# EAGLE design garage (EAGLE 7.6.0)
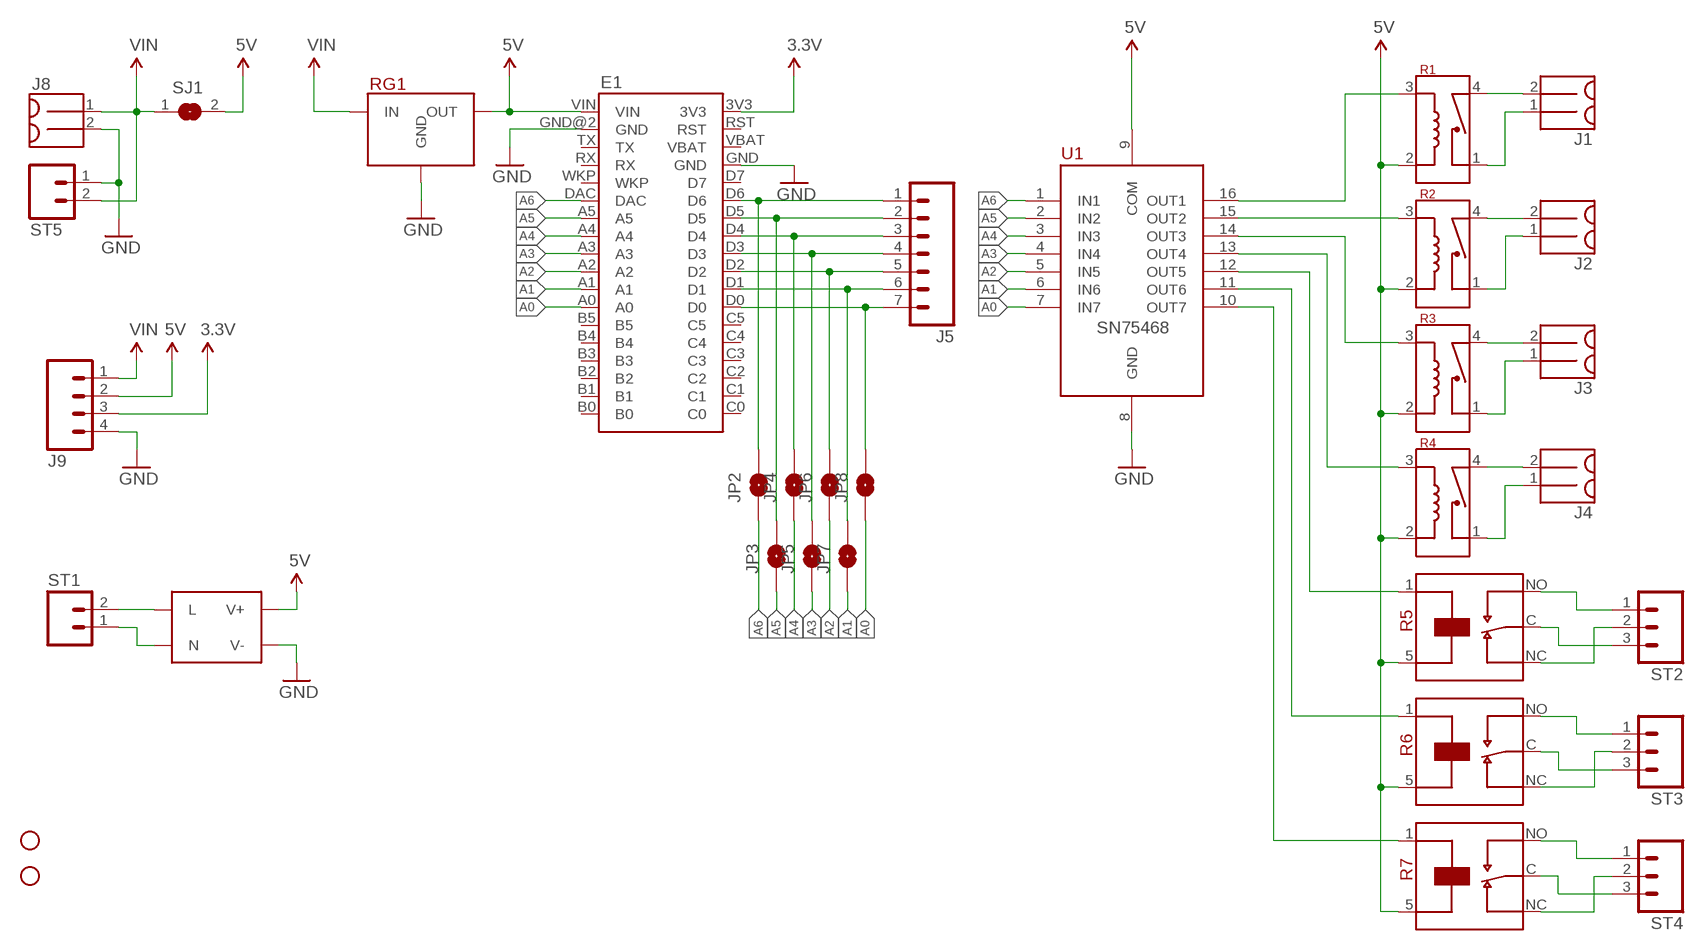
[diagram p0: schematic, sheet 1]

## Parts
E1  ELECTRON  [ELECTRON]
H1  STAND-OFF  [STAND-OFF]
H2  STAND-OFF  [STAND-OFF]
J1  MOLEX_MINILITE_TRAP_2  [MOLEX_MINILITE_TRAP_2]
J2  MOLEX_MINILITE_TRAP_2  [MOLEX_MINILITE_TRAP_2]
J3  MOLEX_MINILITE_TRAP_2  [MOLEX_MINILITE_TRAP_2]
J4  MOLEX_MINILITE_TRAP_2  [MOLEX_MINILITE_TRAP_2]
J5  M07  [1X07]
J8  MOLEX_MINILITE_TRAP_2  [MOLEX_MINILITE_TRAP_2]
J9  M04PTH  [1X04]
JP2  JUMPER-PAD-2-NOYES_SILK  [PAD-JUMPER-2-NO_YES_SILK]
JP3  JUMPER-PAD-2-NOYES_SILK  [PAD-JUMPER-2-NO_YES_SILK]
JP4  JUMPER-PAD-2-NOYES_SILK  [PAD-JUMPER-2-NO_YES_SILK]
JP5  JUMPER-PAD-2-NOYES_SILK  [PAD-JUMPER-2-NO_YES_SILK]
JP6  JUMPER-PAD-2-NOYES_SILK  [PAD-JUMPER-2-NO_YES_SILK]
JP7  JUMPER-PAD-2-NOYES_SILK  [PAD-JUMPER-2-NO_YES_SILK]
JP8  JUMPER-PAD-2-NOYES_SILK  [PAD-JUMPER-2-NO_YES_SILK]
PS1  IRM_03_PS_3W  [IRM_03_PS_3W]
R1  HE3600_RELAY  [HE3600_RELAY]
R2  HE3600_RELAY  [HE3600_RELAY]
R3  HE3600_RELAY  [HE3600_RELAY]
R4  HE3600_RELAY  [HE3600_RELAY]
R5  G2RL_SPDT  [G2RL_SPDT]
R6  G2RL_SPDT  [G2RL_SPDT]
R7  G2RL_SPDT  [G2RL_SPDT]
RG1  MURATA_REG  [MURATA_REG_HOR]
SJ1  SJ  [SJ]
ST1  SCREWTERM_2  [SCREWTERM_0.2X2]
ST2  SCREWTERM_3  [SCREWTERM_0.2X3]
ST3  SCREWTERM_3  [SCREWTERM_0.2X3]
ST4  SCREWTERM_3  [SCREWTERM_0.2X3]
ST5  SCREWTERM_2  [SCREWTERM_0.2X2]
U1  SN75468  [SOIC16]

## Nets
3.3V: E1.3V3 J9.3
5V: E1.VIN J9.2 PS1.V+ R1.2(R1) R2.2(R1) R3.2(R1) R4.2(R1) R5.5 R6.5 R7.5 RG1.3(OUT) SJ1.2 U1.9(COM)
A0: E1.A0 JP8.1 U1.7(IN7)
A1: E1.A1 JP7.1 U1.6(IN6)
A2: E1.A2 JP6.1 U1.5(IN5)
A3: E1.A3 JP5.1 U1.4(IN4)
A4: E1.A4 JP4.1 U1.3(IN3)
A5: E1.A5 JP3.1 U1.2(IN2)
A6: E1.DAC JP2.1 U1.1(IN1)
GND: E1.GND E1.GND@2(GND) J8.2 J9.4 PS1.V- RG1.2(GND) ST5.1 U1.8(GND)
N$1: PS1.ACL(L) ST1.2
N$2: R4.3(R2) U1.13(OUT4)
N$3: R5.1 U1.12(OUT5)
N$4: R6.1 U1.11(OUT6)
N$5: R7.1 U1.10(OUT7)
N$6: J4.2 R4.4(C2)
N$7: J3.2 R3.4(C2)
N$8: J2.2 R2.4(C2)
N$9: J2.1 R2.1(C1)
N$10: J3.1 R3.1(C1)
N$11: J4.1 R4.1(C1)
N$12: J1.2 R1.4(C2)
N$13: J1.1 R1.1(C1)
N$14: R6.NO ST3.1
N$15: R6.NC ST3.2
N$16: R5.NO ST2.1
N$17: R5.C ST2.3
N$18: R6.C ST3.3
N$19: R7.NC ST4.2
N$20: R7.C ST4.3
N$21: R5.NC ST2.2
N$22: R2.3(R2) U1.15(OUT2)
N$23: PS1.ACN(N) ST1.1
N$25: R7.NO ST4.1
N$30: E1.D0 J5.7 JP8.2
N$31: E1.D1 J5.6 JP7.2
N$32: E1.D2 J5.5 JP6.2
N$33: R1.3(R2) U1.16(OUT1)
N$34: E1.D3 J5.4 JP5.2
N$35: R3.3(R2) U1.14(OUT3)
N$36: E1.D4 J5.3 JP4.2
N$37: E1.D5 J5.2 JP3.2
N$38: E1.D6 J5.1 JP2.2
VIN: J8.1 J9.1 RG1.1(IN) SJ1.1 ST5.2
Unconnected: E1.B0 E1.B1 E1.B2 E1.B3 E1.B4 E1.B5 E1.C0 E1.C1 E1.C2 E1.C3 E1.C4 E1.C5 E1.D7 E1.RST E1.RX E1.TX E1.VBAT E1.WKP

## Library data of the parts
E1 = Puffin:ELECTRON
H1 H2 = SparkFun-Electromechanical:STAND-OFF: #4 Stand Off This is the mechanical footprint for a #4 phillips button head screw. Use the keepout ring to avoid running the screw head into surrounding components. SKU : PRT-00447
J1-J4 J8 = Puffin:MOLEX_MINILITE_TRAP_2
J5 = SparkFun-Connectors:M07: Header 7 Standard 7-pin 0.1" header. Use with straight break away headers (SKU : PRT-00116), right angle break away headers (PRT-00553), swiss pins (PRT-00743), machine pins (PRT-00117), and female headers (PRT-00115). NOTES ON THE VARIANTS LOCK and LOCK_LONGPADS... This footprint was designed to help hold the alignment of a through-hole component (i.e. 7-pin header) while soldering it into place. You may notice that each hole has been shifted either up or down by 0.005 of an inch from it's more standard position (which is usually a perfectly straight line). This slight alteration caused the pins (the squares in the middle) to touch the edges of the holes. Because they are alternating, it causes a "brace" to hold the header in place. 0.005 has proven to be the perfect amount of "off-center" position when using our standard breakaway headers. Although looks a little odd when you look at the bare footprint, once you have a header in there, the alteration is very hard to notice. Also, if you push a header all the way into place, it is covered up entirely on the bottom side. This idea of altering the position of holes to aid alignment will be further integrated into the Sparkfun Library for other footprints. It can help hold any component with 3 or more connection pins.
J9 = SparkFun-Connectors:M04: Header 4 Standard 4-pin 0.1" header. Use with straight break away headers (SKU : PRT-00116), right angle break away headers (PRT-00553), swiss pins (PRT-00743), machine pins (PRT-00117), and female headers (PRT-00115). Molex polarized connector foot print use with SKU : PRT-08231 with associated crimp pins and housings. 1MM SMD Version SKU: PRT-10208; PROD_ID: CONN-09696
JP2-JP8 = SparkFun-Passives:JUMPER-PAD-2-NO
PS1 = Puffin:IRM_03_PS_3W
R1-R4 = Puffin:HE3600_RELAY
R5-R7 = Puffin:G2RL_SPDT
RG1 = Puffin:MURATA_REG
SJ1 = jumper:SJ: SMD solder JUMPER
ST1 ST5 = Puffin:SCREWTERM_2
ST2-ST4 = Puffin:SCREWTERM_3
U1 = Puffin:SN75468

## Board
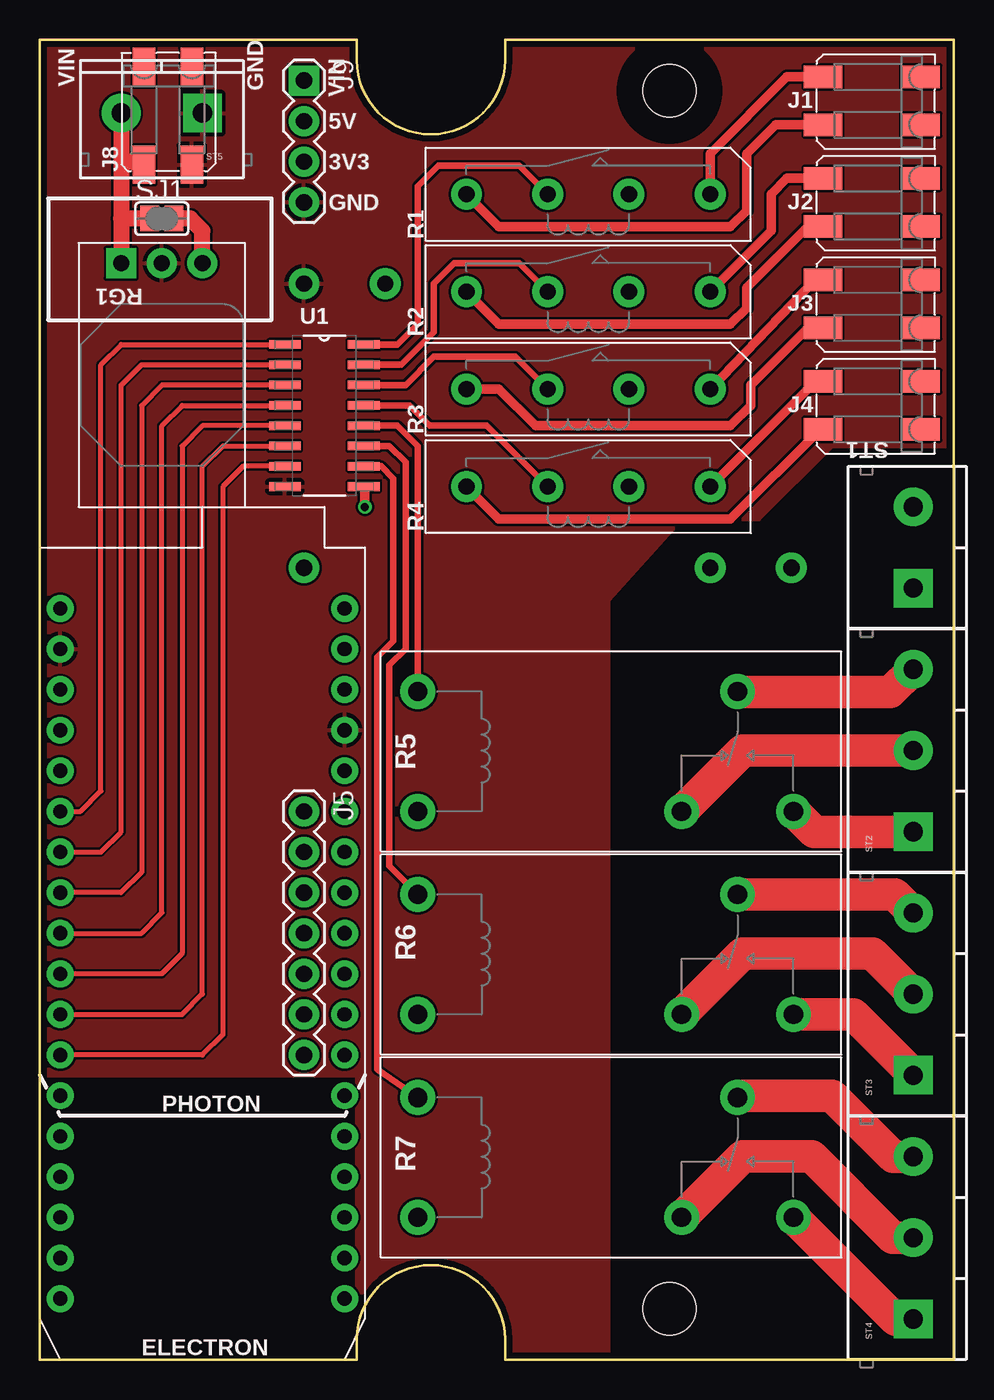
[diagram p1: board, top side]
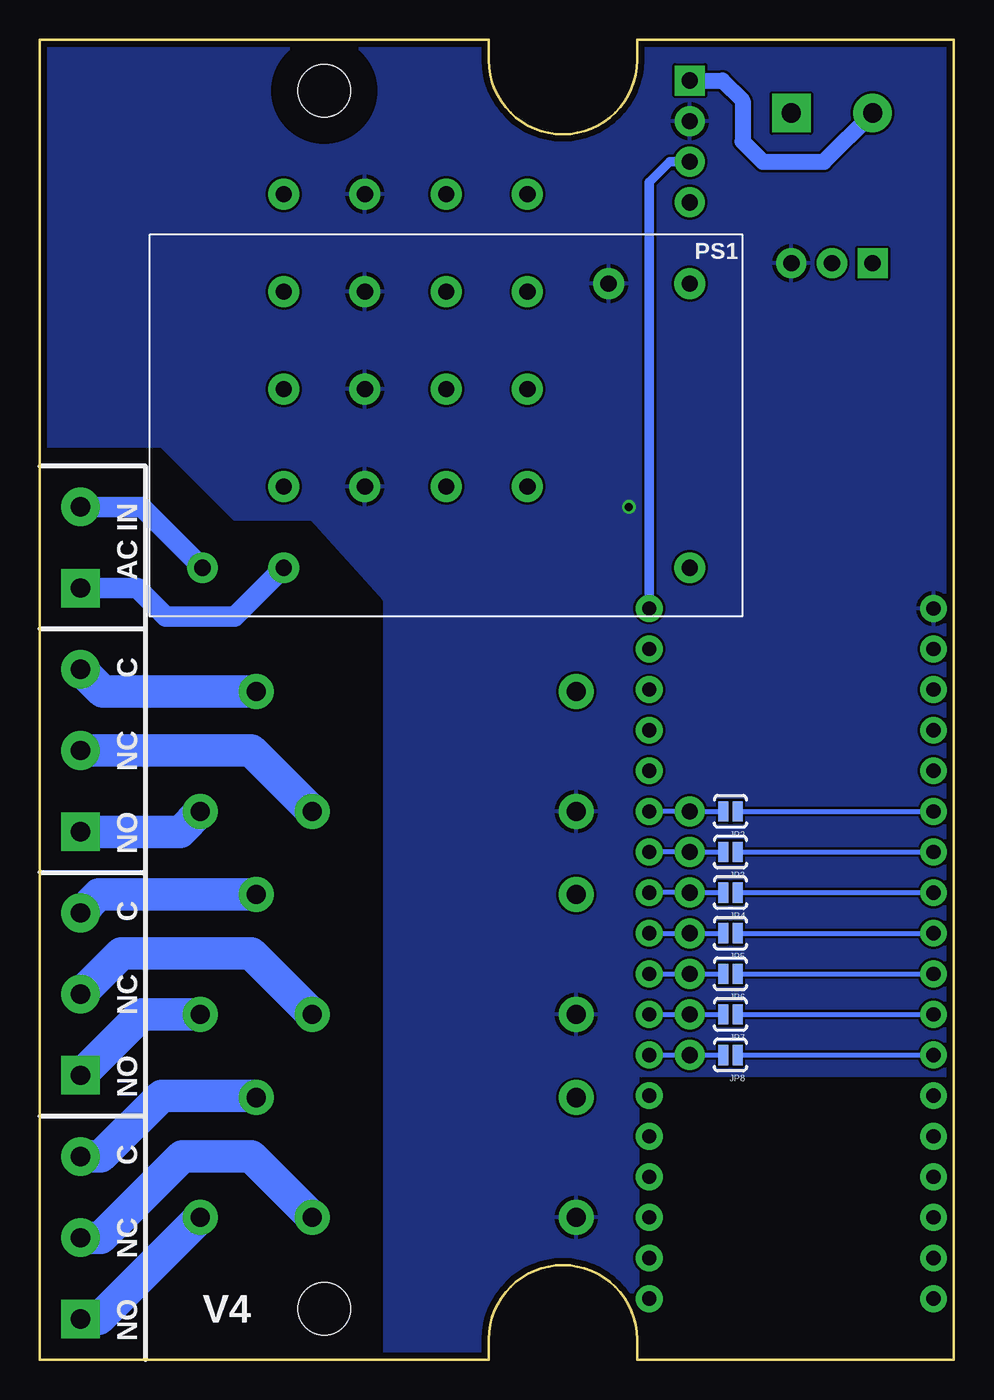
[diagram p2: board, bottom side, seen from below]

Size 57.15 x 82.55 mm. Coordinates in mm from the lower left corner, seen from the top.
Outline: 0,0 19.81,0 19.81,1.27 arc-180 29.08,1.27 29.08,0 57.15,0 57.15,82.55 29.08,82.55 29.08,81.28 arc-180 19.81,81.28 19.81,82.55 0,82.55 0,0
Copper layers (1*16): Top 0.0356mm / dielectric 1.5011mm / Bottom 0.0356mm
Design rules "oshpark-2layer": minimum track width 6mil, minimum drill 13mil, track to track 6mil, track to pad 6mil, pad to pad 6mil, via to via 6mil, smd to smd 6mil, copper to edge 15mil, drill to drill 6mil, minimum pad ring 7mil, minimum via ring 7mil, stop-mask expansion 2.5mil, vias tented up to drill 0mil, thermal gap 10mil
tRestrict: area 36.2,76.2 to 42.5,82.5
bRestrict: area 36.2,76.2 to 42.5,82.5

### Footprints (pad centres in the part's own frame; a part is rotated, then mirrored left to right if it is on the bottom)
ELECTRON = drill 0.889 pad 1.676: 3V3 17.78,0; A0 0,-27.94; A1 0,-25.4; A2 0,-22.86; A3 0,-20.32; A4 0,-17.78; A5 0,-15.24; B0 0,-43.18; B1 0,-40.64; B2 0,-38.1; B3 0,-35.56; B4 0,-33.02; B5 0,-30.48; C0 17.78,-43.18; C1 17.78,-40.64; C2 17.78,-38.1; C3 17.78,-35.56; C4 17.78,-33.02; C5 17.78,-30.48; D0 17.78,-27.94; D1 17.78,-25.4; D2 17.78,-22.86; D3 17.78,-20.32; D4 17.78,-17.78; D5 17.78,-15.24; D6 17.78,-12.7; D7 17.78,-10.16; DAC 0,-12.7; GND 17.78,-7.62; GND@2 0,-2.54; RST 17.78,-2.54; RX 0,-7.62; TX 0,-5.08; VBAT 17.78,-5.08; VIN 0,0; WKP 0,-10.16
STAND-OFF = hole 3.302: 0,0
MOLEX_MINILITE_TRAP_2 = smd 2.4 x 1.4: 1 -3.1,1.5; 2 -3.1,-1.5; 3 3,1.5; 4 3,-1.5
1X07 = drill 1.016 pad 1.88: 1 0,0; 2 2.54,0; 3 5.08,0; 4 7.62,0; 5 10.16,0; 6 12.7,0; 7 15.24,0
1X04 = drill 1.016 pad 1.88 square: 1 0,0 | drill 1.016 pad 1.88: 2 2.54,0; 3 5.08,0; 4 7.62,0
PAD-JUMPER-2-NO_YES_SILK = smd 0.635 x 1.27: 1 -0.45,0; 2 0.45,0
IRM_03_PS_3W = drill 1.016 pad 1.93: ACL 30.48,17.78; ACN 25.4,17.78; NC 0,17.78; V+ 5.08,0; V- 0,0
HE3600_RELAY = drill 1.016 pad 1.93: 1 0,0; 2 0,-5.08; 3 0,-10.16; 4 0,-15.24
G2RL_SPDT = drill 1.2 pad 2.184: 1 -7.5,0; 5 0,0; C -7.5,20; NC 0,16.5; NO 0,23.5
MURATA_REG_HOR = drill 1.016 pad 1.88 square: 1 2.54,0 | drill 1.016 pad 1.88: 2 0,0; 3 -2.54,0
SJ = smd 1.168 x 1.6: 1 -0.762,0; 2 0.762,0
SCREWTERM_0.2X2 = drill 1.2 pad 2.413 square: 1 0,0 | drill 1.2 pad 2.413: 2 5.08,0
SCREWTERM_0.2X3 = drill 1.2 pad 2.413 square: 1 0,0 | drill 1.2 pad 2.413: 2 5.08,0; 3 10.16,0
SOIC16 = smd 1.981 x 0.533: 1 -2.464,4.445; 2 -2.464,3.175; 3 -2.464,1.905; 4 -2.464,0.635; 5 -2.464,-0.635; 6 -2.464,-1.905; 7 -2.464,-3.175; 8 -2.464,-4.445; 9 2.464,-4.445; 10 2.464,-3.175; 11 2.464,-1.905; 12 2.464,-0.635; 13 2.464,0.635; 14 2.464,1.905; 15 2.464,3.175; 16 2.464,4.445

### Placement (x,y rotation side)
E1  1.27,46.99 0 top
H1  39.37,3.17 0 top
H2  39.37,79.38 0 top
J1  52.07,78.74 0 top
J2  52.07,72.39 0 top
J3  52.07,66.04 0 top
J4  52.07,59.69 0 top
J5  16.51,34.29 270 top
J8  8,77.85 90 top
J9  16.51,80.01 270 top
JP2  13.97,34.29 180 bottom
JP3  13.97,31.75 180 bottom
JP4  13.97,29.21 180 bottom
JP5  13.97,26.67 180 bottom
JP6  13.97,24.13 180 bottom
JP7  13.97,21.59 180 bottom
JP8  13.97,19.05 180 bottom
PS1  16.51,67.31 180 bottom
R1  41.91,72.9 270 top
R2  41.91,66.8 270 top
R3  41.91,60.71 270 top
R4  41.91,54.61 270 top
R5  23.62,34.29 270 top
R6  23.62,21.59 270 top
R7  23.62,8.89 270 top
RG1  7.62,68.58 180 top
SJ1  7.62,71.37 0 top
ST1  54.61,48.26 90 top
ST2  54.61,33.02 90 top
ST3  54.61,17.78 90 top
ST4  54.61,2.54 90 top
ST5  10.16,77.98 180 top
U1  17.78,59.05 0 top

### Tracks (layer width: path | path; a pad name or v marks a point on that pad's centre or on a via)
3.3V
  Bottom 0.61: E1.3V3 19.05,73.66 17.78,74.93 J9.3
5V  (via drill 0.5)
  Top 0.61: U1.9 20.32,54.53 v20.32,53.34
  Top 1.016: RG1.3 10.16,70.61 9.4,71.37 SJ1.2
  pour Bottom: -3.81,86.36 -3.81,17.78 19.81,17.78 19.81,-2.54 35.56,-2.54 35.56,47.5 40.13,52.58 44.96,52.58 49.53,57.15 59.69,57.15 59.69,86.36
A0
  Top 0.305: U1.7 12.7,55.88 11.43,54.61 11.43,20.32 10.16,19.05 E1.A0
  Bottom 0.305: JP8.1 E1.A0
A1
  Top 0.305: E1.A1 8.89,21.59 10.16,22.86 10.16,55.88 11.43,57.15 U1.6
  Bottom 0.305: JP7.1 E1.A1
A2
  Top 0.305: U1.5 10.16,58.42 8.89,57.15 8.89,25.4 7.62,24.13 E1.A2
  Bottom 0.305: JP6.1 E1.A2
A3
  Top 0.305: E1.A3 6.35,26.67 7.62,27.94 7.62,58.42 8.89,59.69 U1.4
  Bottom 0.305: JP5.1 E1.A3
A4
  Top 0.305: U1.3 7.62,60.96 6.35,59.69 6.35,30.48 5.08,29.21 E1.A4
  Bottom 0.305: JP4.1 E1.A4
A5
  Top 0.305: E1.A5 3.81,31.75 5.08,33.02 5.08,60.96 6.35,62.23 U1.2
  Bottom 0.305: JP3.1 E1.A5
A6
  Top 0.305: E1.DAC 2.54,34.29 3.81,35.56 3.81,62.23 5.08,63.5 U1.1
  Bottom 0.305: JP2.1 E1.DAC
GND
  pour Top: -2.54,85.09 -2.54,17.78 19.81,17.78 19.81,-1.27 35.56,-1.27 35.56,47.5 40.13,52.58 44.96,52.58 49.53,57.15 58.42,57.15 58.42,85.09
N$1
  Bottom 1.27: ST1.2 50.8,53.34 PS1.ACL
N$2
  Top 0.406: U1.13 23.11,59.69 24.38,58.42 27.94,58.42 R4.3
N$3
  Top 0.406: U1.12 22.35,58.42 23.62,57.15 R5.1
N$4
  Top 0.406: U1.11 21.84,57.15 22.86,56.13 22.86,44.45 21.84,43.43 21.84,30.87 R6.1
N$5
  Top 0.406: U1.10 21.34,55.88 22.1,55.12 22.1,44.96 21.08,43.94 21.08,18.17 R7.1
N$6
  Top 0.61: J4.2 48.79,58.19 43.18,52.58 28.7,52.58 R4.4
N$7
  Top 0.61: J3.2 48.03,64.54 44.45,60.96 44.45,59.69 43.18,58.42 30.99,58.42 28.7,60.71 R3.4
N$8
  Top 0.61: R2.4 28.7,64.77 43.18,64.77 44.2,65.79 44.2,67.06 48.03,70.89 J2.2
N$9
  Top 0.61: J2.1 46.71,73.89 45.72,72.9 45.72,70.61 R2.1
N$10
  Top 0.61: J3.1 48.49,67.54 R3.1
N$11
  Top 0.61: J4.1 48.49,61.19 R4.1
N$12
  Top 0.61: J1.2 46,77.24 44.2,75.44 44.2,71.88 43.18,70.87 28.7,70.87 R1.4
N$13
  Top 0.61: J1.1 46.71,80.24 41.91,75.44 R1.1
N$14
  Bottom 2.032: ST3.1 50.8,21.59 R6.NO
N$15
  Bottom 2.032: R6.NC 43.93,25.4 52.07,25.4 ST3.2
N$16
  Top 2.032: 47.17,34.27 48.41,33.02 ST2.1
  Bottom 2.032: R5.NO 48.39,33.02 ST2.1
N$17
  Top 2.032: 43.66,41.76 53.19,41.76 ST2.3
  Bottom 2.032: ST2.3 53.22,41.79 R5.C
N$18
  Top 2.032: 43.59,29.08 53.47,29.08 ST3.3
  Bottom 2.032: ST3.3 53.46,29.09 R6.C
N$19
  Top 2.032: ST4.2 53.34,7.62 48.26,12.7 43.94,12.7 40.13,8.89
  Bottom 2.032: R7.NC 43.93,12.7 48.26,12.7 53.34,7.62 ST4.2
N$20
  Bottom 2.032: R7.C 43.74,16.51 49.53,16.51 53.34,12.7 ST4.3
N$21
  Top 2.032: 40.11,34.27 43.94,38.1 ST2.2
  Bottom 2.032: R5.NC 43.93,38.1 ST2.2
N$22
  Top 0.406: U1.15 22.61,62.23 24.64,64.26 24.64,67.31 25.91,68.58 29.97,68.58 R2.3
N$23
  Bottom 1.27: ST1.1 51.05,48.26 49.28,46.48 44.96,46.48 PS1.ACN
N$25
  Bottom 2.032: R7.NO 53.47,2.54 ST4.1
N$26
  Top 2.032: 40.13,21.59 43.94,25.4 52.05,25.4 54.59,22.86
N$27
  Top 2.032: 54.66,17.78 50.85,21.59 47.12,21.59
N$28
  Top 2.032: 54.63,12.68 53.37,12.68 49.53,16.51 43.74,16.51 43.61,16.38
N$29
  Top 2.032: 54.61,2.49 53.52,2.49 47.12,8.89
N$30
  Bottom 0.305: E1.D0 J5.7 JP8.2
N$31
  Bottom 0.305: E1.D1 J5.6 JP7.2
N$32
  Bottom 0.305: E1.D2 J5.5 JP6.2
N$33
  Top 0.406: U1.16 22.35,63.5 23.62,64.77 23.62,73.41 24.89,74.68 29.97,74.68 R1.3
N$34
  Bottom 0.305: E1.D3 J5.4 JP5.2
N$35
  Top 0.406: U1.14 22.86,60.96 24.64,62.74 29.72,62.74 R3.3
N$36
  Bottom 0.305: E1.D4 J5.3 JP4.2
N$37
  Bottom 0.305: E1.D5 J5.2 JP3.2
N$38
  Bottom 0.305: E1.D6 J5.1 JP2.2
VIN
  Top 1.016: ST5.2 5.08,74.93 | 5.08,74.93 5.08,71.37 | 5.08,71.37 RG1.1 | SJ1.1 5.08,71.37 | J8.1 5.81,74.93 5.08,74.93
  Bottom 1.016: J9.1 14.48,80.01 13.21,78.74 13.21,76.2 11.94,74.93 8.13,74.93 ST5.2

### Text on the board
tPlace: VIN | GND | VIN | 5V | 3V3 | GND | PHOTON | ELECTRON
bPlace: AC IN | C | NC | NO | C | NC | NO | C | NC | NO | V4